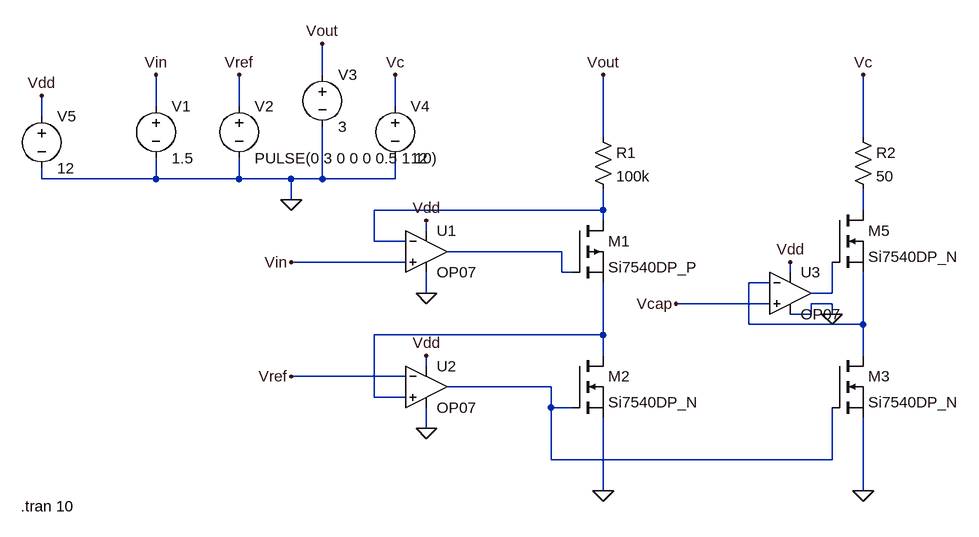
[diagram p0: schematic slope_comp.asc]
slope_comp.asc, the LTspice schematic file:
Version 4
SHEET 1 892 680
WIRE -96 -48 -96 -96
WIRE -352 0 -352 -48
WIRE -224 0 -224 -48
WIRE 16 0 16 -48
WIRE -528 16 -528 -16
WIRE 336 48 336 -48
WIRE 736 48 736 -48
WIRE -528 112 -528 96
WIRE -352 112 -352 80
WIRE -352 112 -528 112
WIRE -224 112 -224 80
WIRE -224 112 -352 112
WIRE -144 112 -224 112
WIRE -96 112 -96 32
WIRE -96 112 -144 112
WIRE 16 112 16 80
WIRE 16 112 -96 112
WIRE -144 144 -144 112
WIRE 336 160 336 128
WIRE 336 160 -16 160
WIRE 736 160 736 128
WIRE 336 176 336 160
WIRE 64 192 64 176
WIRE -16 208 -16 160
WIRE 32 208 -16 208
WIRE 272 224 96 224
WIRE 32 240 -144 240
WIRE 272 256 272 224
WIRE 288 256 272 256
WIRE 624 256 624 240
WIRE 592 272 560 272
WIRE 64 288 64 256
WIRE 688 288 688 240
WIRE 688 288 656 288
WIRE 592 304 448 304
WIRE 688 304 656 304
WIRE 656 320 656 304
WIRE 656 320 624 320
WIRE 688 320 688 304
WIRE 560 336 560 272
WIRE 736 336 736 256
WIRE 736 336 560 336
WIRE 336 352 336 272
WIRE 336 352 -16 352
WIRE 336 384 336 352
WIRE 736 384 736 336
WIRE 64 400 64 384
WIRE 32 416 -144 416
WIRE 256 432 96 432
WIRE -16 448 -16 352
WIRE 32 448 -16 448
WIRE 256 464 256 432
WIRE 288 464 256 464
WIRE 64 496 64 464
WIRE 256 544 256 464
WIRE 688 544 688 464
WIRE 688 544 256 544
WIRE 336 592 336 480
WIRE 736 592 736 480
FLAG 336 592 0
FLAG 736 592 0
FLAG 448 304 Vcap
FLAG 336 -48 Vout
FLAG 736 -48 Vc
FLAG -144 240 Vin
FLAG -144 416 Vref
FLAG -144 144 0
FLAG -352 -48 Vin
FLAG -224 -48 Vref
FLAG -96 -96 Vout
FLAG 16 -48 Vc
FLAG 64 288 0
FLAG 64 496 0
FLAG 688 320 0
FLAG -528 -16 Vdd
FLAG 64 176 Vdd
FLAG 64 384 Vdd
FLAG 624 240 Vdd
SYMBOL res 320 32 R0
SYMATTR InstName R1
SYMATTR Value 100k
SYMBOL res 720 32 R0
SYMATTR InstName R2
SYMATTR Value 50
SYMBOL pmos 288 176 R0
SYMATTR InstName M1
SYMATTR Value Si7540DP_P
SYMBOL nmos 288 384 R0
SYMATTR InstName M2
SYMATTR Value Si7540DP_N
SYMBOL nmos 688 384 R0
SYMATTR InstName M3
SYMATTR Value Si7540DP_N
SYMBOL nmos 688 160 R0
SYMATTR InstName M5
SYMATTR Value Si7540DP_N
SYMBOL voltage -352 -16 R0
WINDOW 123 0 0 Left 0
WINDOW 39 0 0 Left 0
SYMATTR InstName V1
SYMATTR Value 1.5
SYMBOL voltage -224 -16 R0
WINDOW 123 0 0 Left 0
WINDOW 39 0 0 Left 0
SYMATTR InstName V2
SYMATTR Value PULSE(0 3 0 0 0 0.5 1 10)
SYMBOL voltage -96 -64 R0
WINDOW 123 0 0 Left 0
WINDOW 39 0 0 Left 0
SYMATTR InstName V3
SYMATTR Value 3
SYMBOL voltage 16 -16 R0
WINDOW 123 0 0 Left 0
WINDOW 39 0 0 Left 0
SYMATTR InstName V4
SYMATTR Value 12
SYMBOL Opamps\\OP07 64 160 R0
SYMATTR InstName U1
SYMBOL Opamps\\OP07 64 368 R0
SYMATTR InstName U2
SYMBOL Opamps\\OP07 624 224 R0
SYMATTR InstName U3
SYMBOL voltage -528 0 R0
WINDOW 123 0 0 Left 0
WINDOW 39 0 0 Left 0
SYMATTR InstName V5
SYMATTR Value 12
TEXT -560 616 Left 2 !.tran 10

The netlist it stands for:
* slope_comp.asc
R1 Vout N001 100k
R2 Vc N002 50
M1 N001 N003 N006 N006 Si7540DP_P
M2 N006 N007 0 0 Si7540DP_N
M3 N004 N007 0 0 Si7540DP_N
M5 N002 N005 N004 N004 Si7540DP_N
V1 Vin 0 1.5
V2 Vref 0 PULSE(0 3 0 0 0 0.5 1 10)
V3 Vout 0 3
V4 Vc 0 12
XU1 Vin N001 Vdd 0 N003 LT1001  ; OP07, pins In+ In- V+ V- OUT
XU2 N006 Vref Vdd 0 N007 LT1001  ; OP07, pins In+ In- V+ V- OUT
XU3 Vcap N004 Vdd 0 N005 LT1001  ; OP07, pins In+ In- V+ V- OUT
V5 Vdd 0 12
.model NMOS NMOS
.model PMOS PMOS
.lib standard.mos
.tran 10
.lib LTC.lib
.backanno
.end